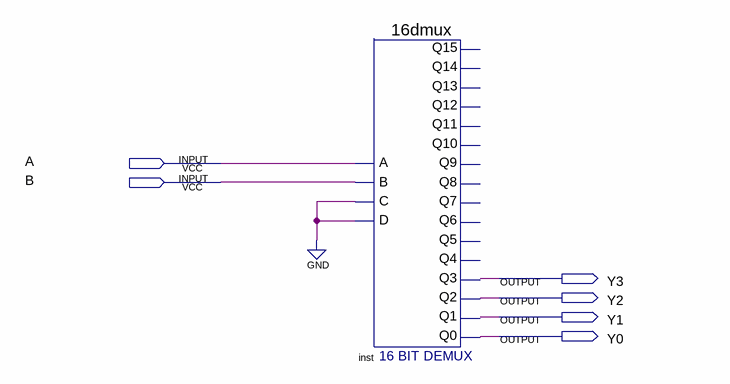
[diagram p0: schematic sheet]
// Quartus schematic Decoder.bdf as structural Verilog: 1 symbols, 6 pins
module Decoder (
  input  A,
  input  B,
  output Y3,
  output Y2,
  output Y1,
  output Y0
);

  \16dmux  inst (
    .C(1'b0), .B(B), .A(A), .D(1'b0), .Q2(Y2), .Q3(Y3), .Q0(Y0), .Q1(Y1));  // open: Q12, Q13, Q11, Q9, Q10, Q7, Q8, Q4, Q5, Q6, Q14, Q15
endmodule
